# EAGLE design anemo5 (EAGLE 6.6.0)
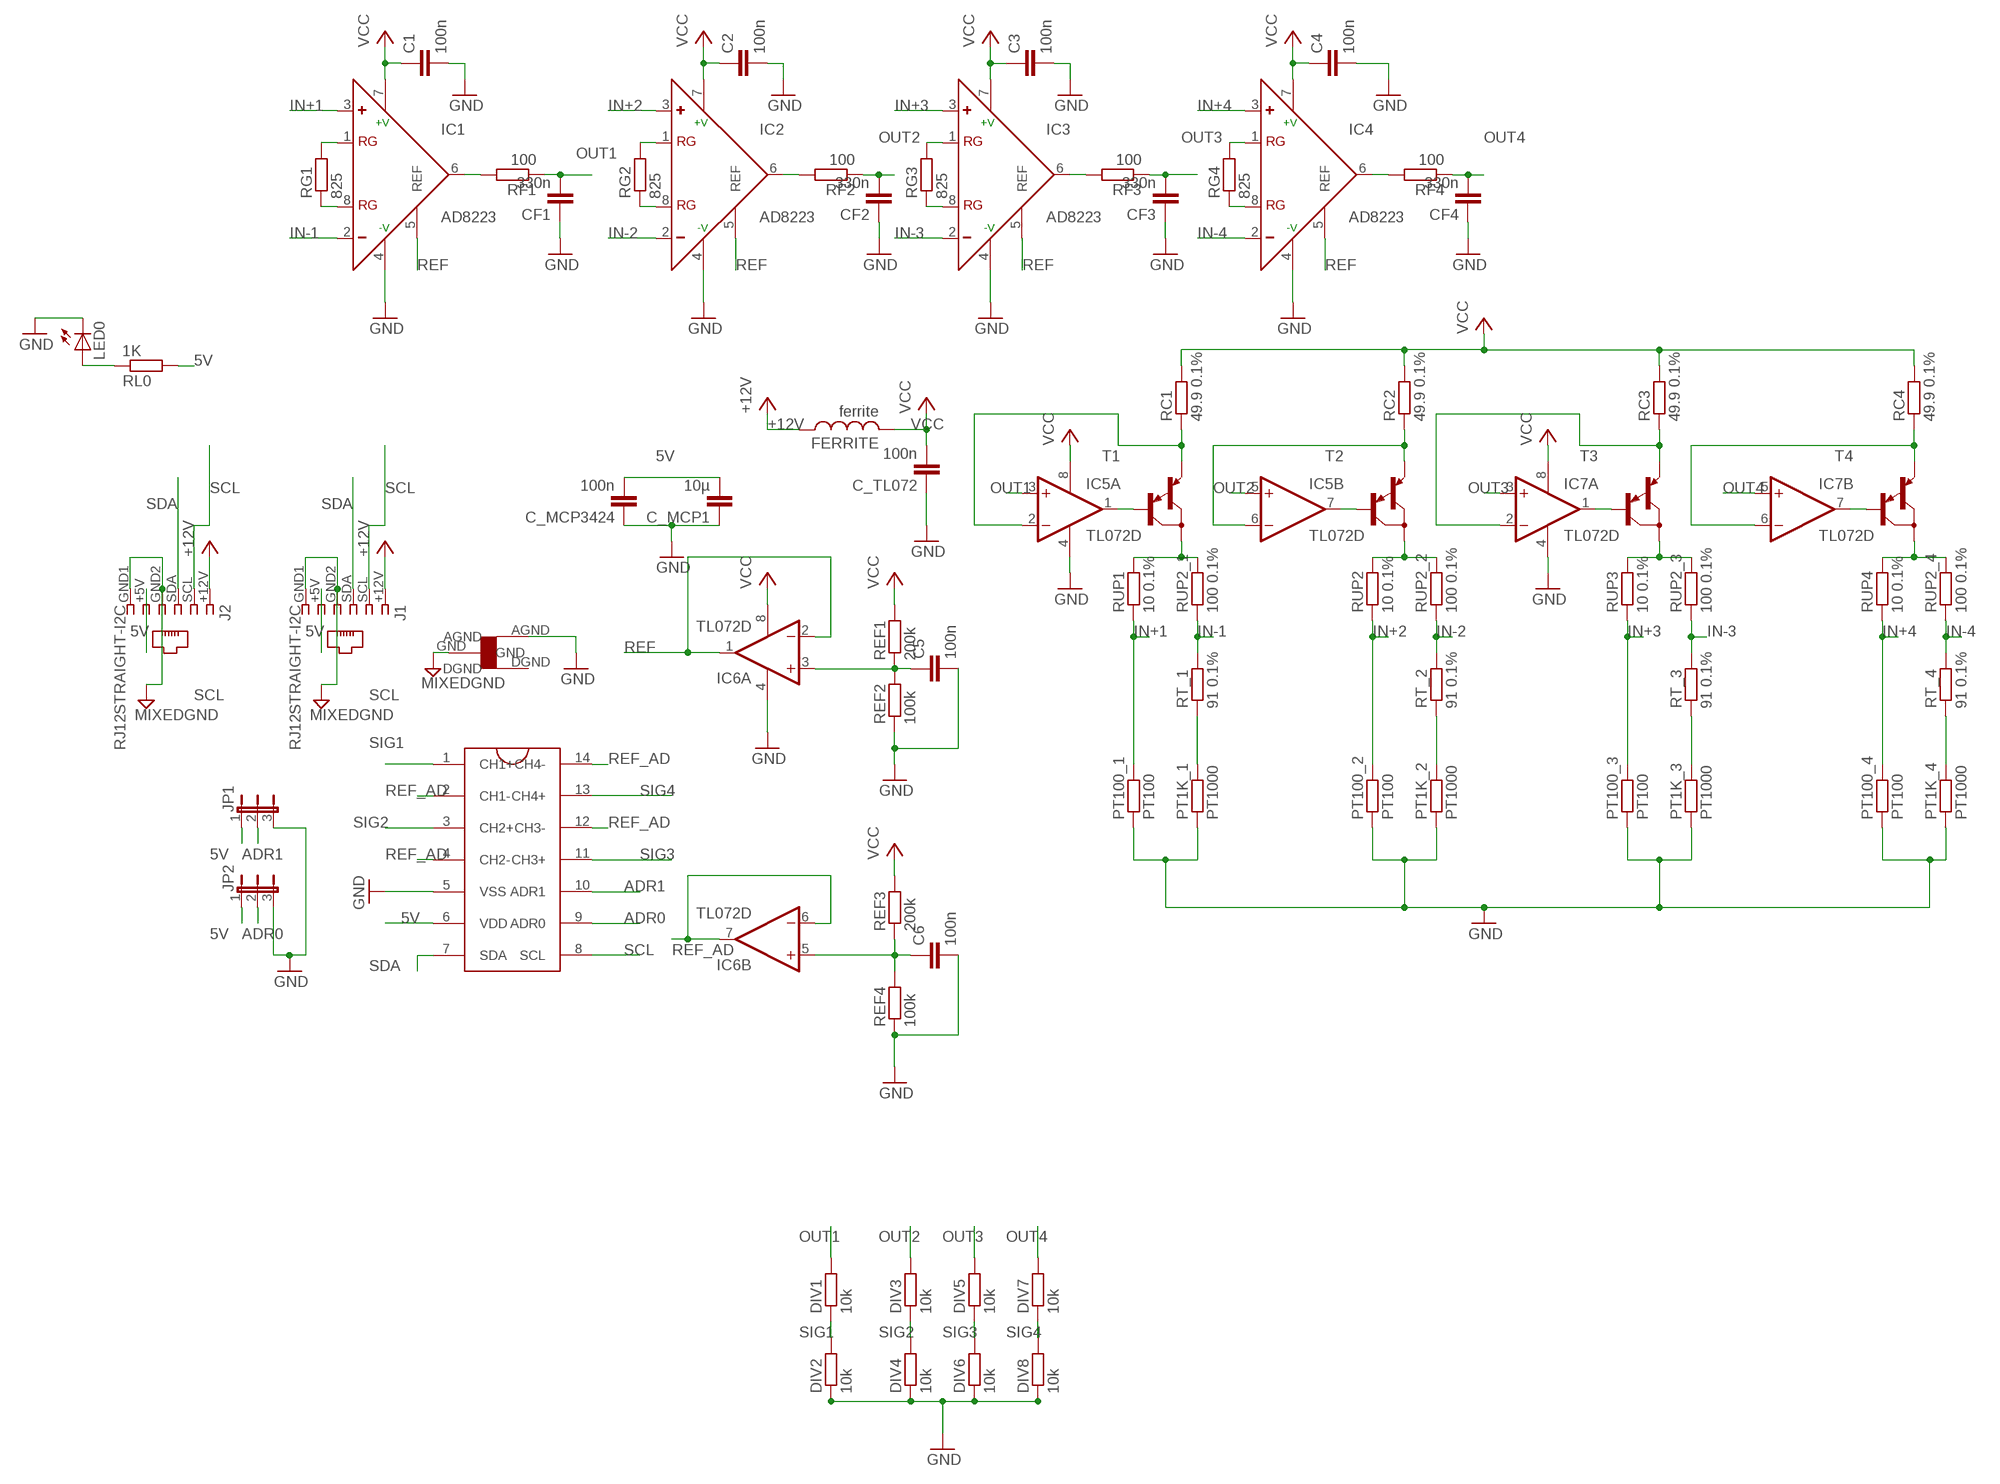
[diagram p0: schematic, sheet 1]

## Parts
C1  100n  C-EUC1206  [C1206]
C2  100n  C-EUC1206  [C1206]
C3  100n  C-EUC1206  [C1206]
C4  100n  C-EUC1206  [C1206]
C5  100n  C-EUC1206  [C1206]
C6  100n  C-EUC1206  [C1206]
C_MCP1  10µ  C-EUC1206  [C1206]
C_MCP3424  100n  C-EUC1206  [C1206]
C_TL072  100n  C-EUC1206  [C1206]
CF1  330n  C-EUC1206  [C1206]
CF2  330n  C-EUC1206  [C1206]
CF3  330n  C-EUC1206  [C1206]
CF4  330n  C-EUC1206  [C1206]
DIV1  10k  R-EU_M1206  [M1206]
DIV2  10k  R-EU_M1206  [M1206]
DIV3  10k  R-EU_M1206  [M1206]
DIV4  10k  R-EU_M1206  [M1206]
DIV5  10k  R-EU_M1206  [M1206]
DIV6  10k  R-EU_M1206  [M1206]
DIV7  10k  R-EU_M1206  [M1206]
DIV8  10k  R-EU_M1206  [M1206]
FERRITE  ferrite  L-USL3216C  [L3216C]
IC1  AD8223  AD620R  [SO8]
IC2  AD8223  AD620R  [SO8]
IC3  AD8223  AD620R  [SO8]
IC4  AD8223  AD620R  [SO8]
IC5  TL072D  [SO08]
IC6  TL072D  [SO08]
IC7  TL072D  [SO08]
J1  RJ12STRAIGHT-I2C  [RJ12-STRAIGHT-I2C]
J2  RJ12STRAIGHT-I2C  [RJ12-STRAIGHT-I2C]
JP1  JP2E  [JP2]
JP2  JP2E  [JP2]
LED0  LED1206  [LED-1206]
PT1K_1  PT1000  R-EU_M1206  [M1206]
PT1K_2  PT1000  R-EU_M1206  [M1206]
PT1K_3  PT1000  R-EU_M1206  [M1206]
PT1K_4  PT1000  R-EU_M1206  [M1206]
PT100_1  PT100  R-EU_M1206  [M1206]
PT100_2  PT100  R-EU_M1206  [M1206]
PT100_3  PT100  R-EU_M1206  [M1206]
PT100_4  PT100  R-EU_M1206  [M1206]
RC1  49.9 0.1%  R-EU_M1206  [M1206]
RC2  49.9 0.1%  R-EU_M1206  [M1206]
RC3  49.9 0.1%  R-EU_M1206  [M1206]
RC4  49.9 0.1%  R-EU_M1206  [M1206]
REF1  200k  R-EU_M1206  [M1206]
REF2  100k  R-EU_M1206  [M1206]
REF3  200k  R-EU_M1206  [M1206]
REF4  100k  R-EU_M1206  [M1206]
RF1  100  R-EU_M1206  [M1206]
RF2  100  R-EU_M1206  [M1206]
RF3  100  R-EU_M1206  [M1206]
RF4  100  R-EU_M1206  [M1206]
RG1  825  R-EU_M1206  [M1206]
RG2  825  R-EU_M1206  [M1206]
RG3  825  R-EU_M1206  [M1206]
RG4  825  R-EU_M1206  [M1206]
RL0  1K  R-EU_M1206  [M1206]
RT_1  91 0.1%  R-EU_M1206  [M1206]
RT_2  91 0.1%  R-EU_M1206  [M1206]
RT_3  91 0.1%  R-EU_M1206  [M1206]
RT_4  91 0.1%  R-EU_M1206  [M1206]
RUP1  10 0.1%  R-EU_M1206  [M1206]
RUP2  10 0.1%  R-EU_M1206  [M1206]
RUP2_1  100 0.1%  R-EU_M1206  [M1206]
RUP2_2  100 0.1%  R-EU_M1206  [M1206]
RUP2_3  100 0.1%  R-EU_M1206  [M1206]
RUP2_4  100 0.1%  R-EU_M1206  [M1206]
RUP3  10 0.1%  R-EU_M1206  [M1206]
RUP4  10 0.1%  R-EU_M1206  [M1206]
T1  MMBTA64LT1-PNP_DARL-SOT23-BEC  [SOT23-BEC]
T2  MMBTA64LT1-PNP_DARL-SOT23-BEC  [SOT23-BEC]
T3  MMBTA64LT1-PNP_DARL-SOT23-BEC  [SOT23-BEC]
T4  MMBTA64LT1-PNP_DARL-SOT23-BEC  [SOT23-BEC]
U$1  MCP3424(SO14)  [14LDSOIC]
U$2  STARGND  [STAR]

## Nets
5V: C_MCP1.2 C_MCP3424.2 J1.+5V J2.+5V JP1.1 JP2.1 RL0.2 U$1.6(VDD)
+12V: FERRITE.1 J1.+12V J2.+12V
ADR0: JP2.2 U$1.9(ADR0)
ADR1: JP1.2 U$1.10(ADR1)
GND [gnd]: C1.2 C2.2 C3.2 C4.2 C5.2 C6.2 C_MCP1.1 C_MCP3424.1 C_TL072.1 CF1.1 CF2.1 CF3.1 CF4.1 DIV2.1 DIV4.1 DIV6.1 DIV8.1 IC1.4(-V) IC2.4(-V) IC3.4(-V) IC4.4(-V) IC5.4(P:V-) IC6.4(P:V-) IC7.4(P:V-) JP1.3 JP2.3 LED0.C PT1K_1.1 PT1K_2.1 PT1K_3.1 PT1K_4.1 PT100_1.1 PT100_2.1 PT100_3.1 PT100_4.1 REF2.1 REF4.1 U$1.5(VSS) U$2.AGND
IN+1: IC1.3(+) PT100_1.2 RUP1.1
IN+2: IC2.3(+) PT100_2.2 RUP2.1
IN+3: IC3.3(+) PT100_3.2 RUP3.1
IN+4: IC4.3(+) PT100_4.2 RUP4.1
IN-1: IC1.2(-) RT_1.2 RUP2_1.1
IN-2: IC2.2(-) RT_2.2 RUP2_2.1
IN-3: IC3.2(-) RT_3.2 RUP2_3.1
IN-4: IC4.2(-) RT_4.2 RUP2_4.1
MIXEDGND [gnd]: J1.GND1 J1.GND2 J2.GND1 J2.GND2 U$2.GND
N$1: IC1.1(RG) RG1.2
N$2: IC1.8(RG) RG1.1
N$3: IC2.8(RG) RG2.1
N$4: IC2.1(RG) RG2.2
N$5: IC3.1(RG) RG3.2
N$6: IC3.8(RG) RG3.1
N$7: IC4.1(RG) RG4.2
N$8: IC4.8(RG) RG4.1
N$9: RUP1.2 RUP2_1.2 T1.C
N$10: C5.1 IC6.3(A:+IN) REF1.1 REF2.2
N$11: RUP2.2 RUP2_2.2 T2.C
N$12: RUP2_3.2 RUP3.2 T3.C
N$13: RUP2_4.2 RUP4.2 T4.C
N$14: LED0.A RL0.1
N$15 [highpower]: IC5.2(A:-IN) RC1.1 T1.E
N$16 [highpower]: IC5.6(B:-IN) RC2.1 T2.E
N$17 [highpower]: IC7.2(A:-IN) RC3.1 T3.E
N$18: IC1.6(OUT) RF1.2
N$19: IC2.6(OUT) RF2.2
N$20: IC3.6(OUT) RF3.2
N$21: IC4.6(OUT) RF4.2
N$22 [highpower]: IC7.6(B:-IN) RC4.1 T4.E
N$23: PT1K_1.2 RT_1.1
N$24: C6.1 IC6.5(B:+IN) REF3.1 REF4.2
N$25: PT1K_2.2 RT_2.1
N$27: PT1K_3.2 RT_3.1
N$29: PT1K_4.2 RT_4.1
OUT1: CF1.2 DIV1.2 IC5.3(A:+IN) RF1.1
OUT1A: IC5.1(A:OUT) T1.B
OUT2: CF2.2 DIV3.2 IC5.5(B:+IN) RF2.1
OUT2A: IC5.7(B:OUT) T2.B
OUT3: CF3.2 DIV5.2 IC7.3(A:+IN) RF3.1
OUT3A: IC7.1(A:OUT) T3.B
OUT4: CF4.2 DIV7.2 IC7.5(B:+IN) RF4.1
OUT4A: IC7.7(B:OUT) T4.B
REF: IC1.5(REF) IC2.5(REF) IC3.5(REF) IC4.5(REF) IC6.1(A:OUT) IC6.2(A:-IN)
REF_AD: IC6.6(B:-IN) IC6.7(B:OUT) U$1.2(CH1-) U$1.4(CH2-) U$1.12(CH3-) U$1.14(CH4-)
SCL: J1.SCL J2.SCL U$1.8(SCL)
SDA: J1.SDA J2.SDA U$1.7(SDA)
SIG1: DIV1.1 DIV2.2 U$1.1(CH1+)
SIG2: DIV3.1 DIV4.2 U$1.3(CH2+)
SIG3: DIV5.1 DIV6.2 U$1.11(CH3+)
SIG4: DIV7.1 DIV8.2 U$1.13(CH4+)
VCC [highpower]: C1.1 C2.1 C3.1 C4.1 C_TL072.2 FERRITE.2 IC1.7(+V) IC2.7(+V) IC3.7(+V) IC4.7(+V) IC5.8(P:V+) IC6.8(P:V+) IC7.8(P:V+) RC1.2 RC2.2 RC3.2 RC4.2 REF1.2 REF3.2
Unconnected: U$2.DGND

## Library data of the parts
C1-C6 C_MCP1 C_MCP3424 C_TL072 CF1-CF4 = rcl:C-EU: CAPACITOR, European symbol
DIV1-DIV8 PT1K_1-PT1K_4 PT100_1-PT100_4 RC1-RC4 REF1-REF4 RF1-RF4 RG1-RG4 RL0 RT_1-RT_4 RUP1 RUP2 RUP2_1-RUP2_4 RUP3 RUP4 = resistor:R-EU_: RESISTOR, European symbol
FERRITE = rcl:L-US: INDUCTOR, American symbol
IC1-IC4 = analog-devices:AD620: Low Cost, Low Power, Instrumentation Amplifier Source: http://www.analog.com/UploadedFiles/Data_Sheets/37793330023930AD620_e.pdf; MPN: AD620AR; OC_FARNELL: 1464424; OC_NEWARK: 05F7109
IC5-IC7 = linear:TL072: OP AMP
J1 J2 = lpatiny:RJ12: CORCOM Modular RJ Jacks No Shield Source: www.tycoelectronics.com .. ENG_DS_1654001_1099_RJ_L_0507.pdf
JP1 JP2 = jumper:JP2E: JUMPER
LED0 = SparkFun:LED: LEDs Standard schematic elements and footprints for 5mm, 3mm, 1206, and 0603 sized LEDs. 5mm - Spark Fun Electronics SKU : COM-00529 (and others)
T1-T4 = transistor:*-PNP_DARL-: PNP Darlington Transistor
U$1 = mcp3424:MCP3424(SO14)
U$2 = lpatiny:STARGND

## Net classes
0 default: width 0.406 mm
1 gnd: width 0.406 mm
2 highpower: width 0.61 mm

## Board
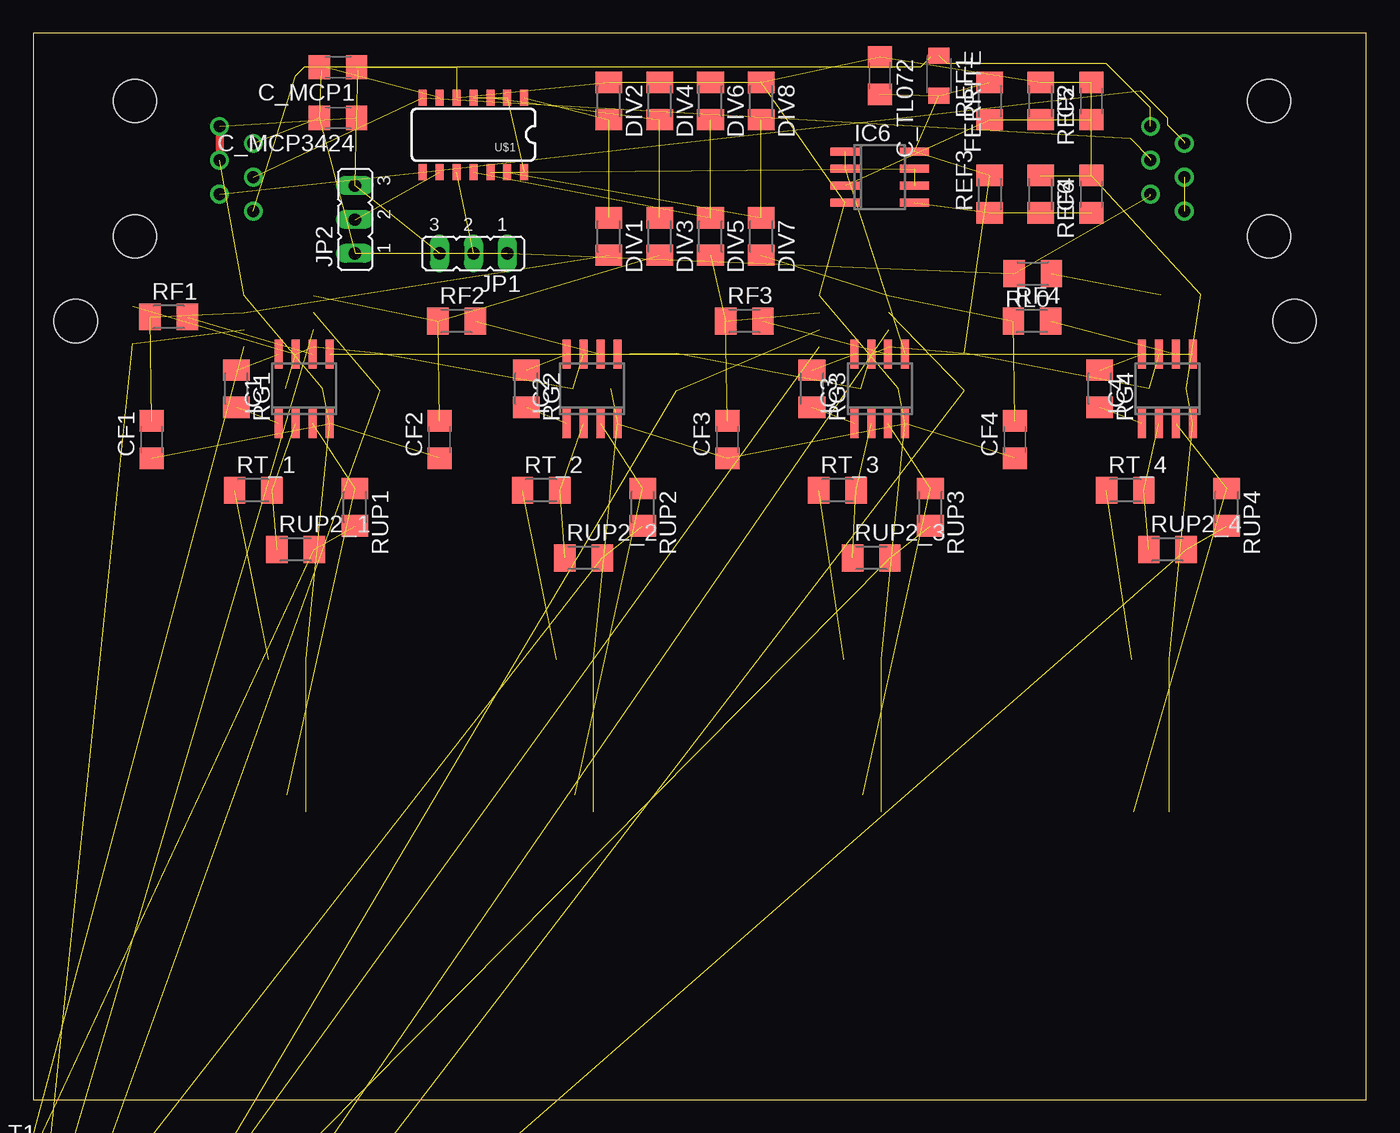
[diagram p1: board, top side]
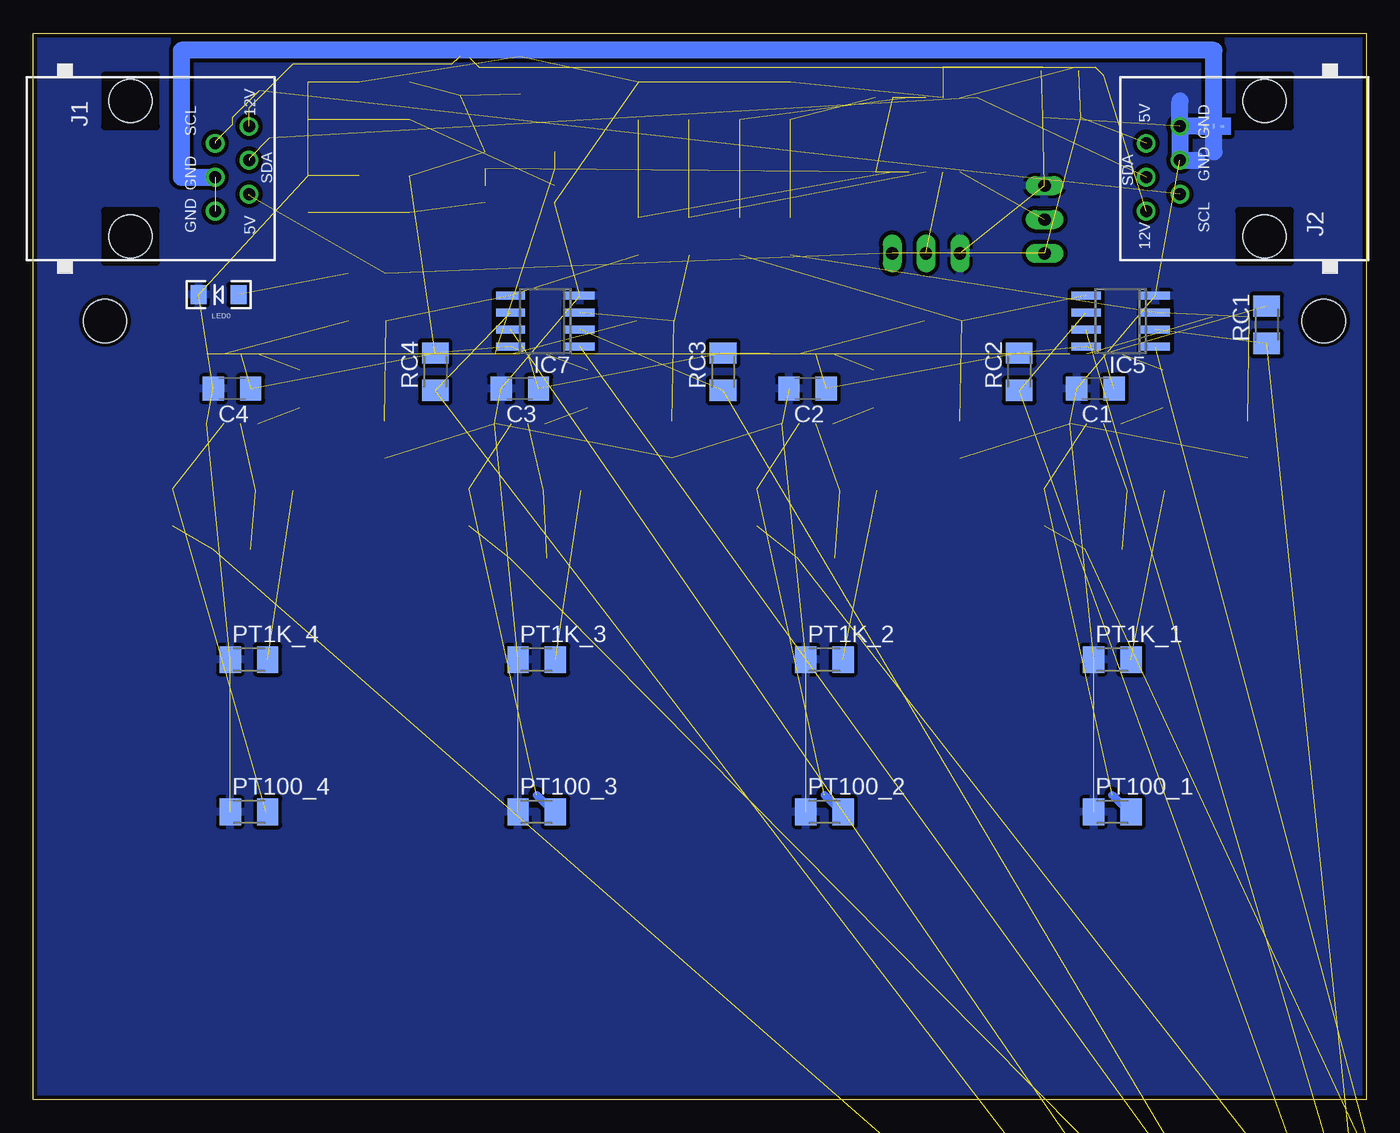
[diagram p2: board, bottom side, seen from below]

Size 100 x 80 mm. Coordinates in mm from the lower left corner, seen from the top.
Outline: 0,0 100,0 100,80 0,80 0,0
Copper layers (1*16): Top 0.035mm / dielectric 1.5mm / Bottom 0.035mm
Design rules "Fusion_eagle_rule_v1.1 *": minimum track width 6mil, minimum drill 0.5mm, track to track 10mil, track to pad 10mil, pad to pad 10mil, via to via 10mil, smd to smd 0mil, copper to edge 10mil, drill to drill 10mil, minimum pad ring 10mil, minimum via ring 6mil, stop-mask expansion 2mil, vias tented up to drill 100mil, thermal gap 10mil
Holes 3.25 mm at 3.17,58.42 94.61,58.42
vRestrict: area -2.5,-1.3 to 102.9,50.8

### Footprints (pad centres in the part's own frame; a part is rotated, then mirrored left to right if it is on the bottom)
C1206 = smd 1.6 x 1.8: 1 -1.4,0; 2 1.4,0
M1206 = smd 1.6 x 2: 1 -1.4,0; 2 1.4,0
L3216C = smd 1.2 x 1.6: 1 -1.5,0; 2 1.5,0
SO8 = smd 0.6 x 2.2: 1 -1.905,-2.6; 2 -0.635,-2.6; 3 0.635,-2.6; 4 1.905,-2.6; 5 1.905,2.6; 6 0.635,2.6; 7 -0.635,2.6; 8 -1.905,2.6
SO08 = smd 0.6 x 2.2: 1 -1.905,-2.6; 2 -0.635,-2.6; 3 0.635,-2.6; 4 1.905,-2.6; 5 1.905,2.6; 6 0.635,2.6; 7 -0.635,2.6; 8 -1.905,2.6
RJ12-STRAIGHT-I2C = drill 0.9 pad 1.4: +5V 1.905,8.89; +12V -3.175,8.89; GND1 3.175,6.35; GND2 0.635,6.35; SCL -1.905,6.35; SDA -0.635,8.89 | hole 3.251: -5.08,0; 5.08,0
JP2 = drill 0.914 long: 1 -2.54,0; 2 0,0; 3 2.54,0
LED-1206 = smd 1.2 x 1.4: A -1.5,0; C 1.5,0
SOT23-BEC = smd 1 x 1.4: B -0.95,-1.1; C 0,1.1; E 0.95,-1.1
14LDSOIC = smd 1.2 x 0.6: 1 -2.8,3.81; 2 -2.8,2.54; 3 -2.8,1.27; 4 -2.8,0; 5 -2.8,-1.27; 6 -2.8,-2.54; 7 -2.8,-3.81; 8 2.8,-3.81; 9 2.8,-2.54; 10 2.8,-1.27; 11 2.8,0; 12 2.8,1.27; 13 2.8,2.54; 14 2.8,3.81
STAR = smd 0.152 x 0.305: AGND 0.635,-0.635; DGND 0.635,0.635 | smd 0.305 x 0.152: GND 0.635,0

### Placement (x,y rotation side)
C1  20.32,53.34 180 bottom
C2  41.91,53.34 180 bottom
C3  63.5,53.34 180 bottom
C4  85.09,53.34 180 bottom
C5  79.38,74.93 90 top
C6  79.38,67.94 90 top
C_MCP1  22.86,77.47 180 top
C_MCP3424  22.86,73.66 180 top
C_TL072  63.5,76.83 270 top
CF1  8.89,49.53 90 top
CF2  30.48,49.53 90 top
CF3  52.07,49.53 90 top
CF4  73.66,49.53 90 top
DIV1  43.18,64.77 270 top
DIV2  43.18,74.93 270 top
DIV3  46.99,64.77 270 top
DIV4  46.99,74.93 270 top
DIV5  50.8,64.77 270 top
DIV6  50.8,74.93 270 top
DIV7  54.61,64.77 270 top
DIV8  54.61,74.93 270 top
FERRITE  67.94,76.83 270 top
IC1  20.32,53.34 0 top
IC2  41.91,53.34 0 top
IC3  63.5,53.34 0 top
IC4  85.09,53.34 0 top
IC5  18.41,58.42 90 bottom
IC6  63.5,69.22 270 top
IC7  61.59,58.42 90 bottom
J1  92.71,69.85 270 bottom
J2  7.62,69.85 90 bottom
JP1  33.02,63.5 180 top
JP2  24.13,66.04 90 top
LED0  86.11,60.4 180 bottom
PT1K_1  19.05,33.02 0 bottom
PT1K_2  40.64,33.02 0 bottom
PT1K_3  62.23,33.02 0 bottom
PT1K_4  83.82,33.02 0 bottom
PT100_1  19.05,21.59 0 bottom
PT100_2  40.64,21.59 0 bottom
PT100_3  62.23,21.59 0 bottom
PT100_4  83.82,21.59 0 bottom
RC1  7.47,58.14 90 bottom
RC2  26.04,54.61 90 bottom
RC3  48.26,54.61 90 bottom
RC4  69.85,54.61 90 bottom
REF1  71.75,74.93 90 top
REF2  75.56,74.93 270 top
REF3  71.75,67.94 90 top
REF4  75.56,67.94 270 top
RF1  10.16,58.72 0 top
RF2  31.75,58.42 0 top
RF3  53.34,58.42 0 top
RF4  74.93,58.42 0 top
RG1  15.24,53.34 270 top
RG2  36.98,53.34 270 top
RG3  58.42,53.34 270 top
RG4  80.01,53.34 270 top
RL0  74.98,61.98 180 top
RT_1  16.51,45.72 0 top
RT_2  38.1,45.72 0 top
RT_3  60.33,45.72 0 top
RT_4  81.92,45.72 0 top
RUP1  24.13,44.45 270 top
RUP2  45.72,44.45 270 top
RUP2_1  19.68,41.27 0 top
RUP2_2  41.27,40.64 0 top
RUP2_3  62.87,40.64 0 top
RUP2_4  85.09,41.27 0 top
RUP3  67.31,44.45 270 top
RUP4  89.53,44.45 270 top
T1  0,-5.08 0 top  (outside the outline)
T2  0,-15.24 0 top  (outside the outline)
T3  0,-25.4 0 top  (outside the outline)
T4  0,-35.56 0 top  (outside the outline)
U$1  33.02,72.39 270 top
U$2  11.43,73.66 270 bottom

### Tracks (layer width: path | path; a pad name or v marks a point on that pad's centre or on a via)
5V  (8 unrouted)
  Top 0.61: 21.84,77.47 C_MCP1.2 21.59,77.22
+12V  (10 unrouted)
  Top 0.61: 67.31,78.23 67.82,78.23 FERRITE.1
ADR0  (1 unrouted)
ADR1  (1 unrouted)
GND  (39 unrouted)
  Top 0.61: C_TL072.1 | 24.38,77.22 C_MCP1.1
  Bottom 1.27: 11.43,71.12 11.43,73.03 U$2.AGND 13.97,73.03 | 13.97,73.03 13.97,74.93 | 13.97,73.03 13.97,70.48 12.7,70.48
  pour Bottom (isolate 0.305): -0.03,80.01 99.69,80.01 99.69,0 0,-0.03
IN+1  (2 unrouted)
  Bottom 0.61: 19.05,22.86 17.78,21.59 PT100_1.2
IN+2  (2 unrouted)
  Bottom 0.61: 40.64,22.86 39.37,21.59 PT100_2.2
IN+3  (2 unrouted)
  Bottom 0.61: 62.23,22.86 60.96,21.59 PT100_3.2
IN+4  (2 unrouted)
  Bottom 0.61: 82.55,21.59 PT100_4.2
IN-1  (2 unrouted)
IN-2  (2 unrouted)
IN-3  (2 unrouted)
IN-4  (2 unrouted)
MIXEDGND  (1 unrouted)
  Top 0.61: J2.GND1 J2.GND2
  Bottom 1.27: J1.GND2 88.9,69.22 88.9,78.74 11.43,78.74 U$2.GND J2.GND1 J2.GND2
N$1  (1 unrouted)
N$2  (1 unrouted)
N$3  (1 unrouted)
N$4  (1 unrouted)
N$5  (1 unrouted)
N$6  (1 unrouted)
N$7  (1 unrouted)
N$8  (1 unrouted)
N$9  (2 unrouted)
N$10  (3 unrouted)
N$11  (2 unrouted)
N$12  (2 unrouted)
N$13  (2 unrouted)
N$14  (1 unrouted)
N$15  (2 unrouted)
N$16  (2 unrouted)
N$17  (2 unrouted)
N$18  (1 unrouted)
N$19  (1 unrouted)
N$20  (1 unrouted)
N$21  (1 unrouted)
N$22  (2 unrouted)
N$23  (1 unrouted)
N$24  (3 unrouted)
N$25  (1 unrouted)
N$27  (1 unrouted)
N$29  (1 unrouted)
OUT1  (3 unrouted)
OUT1A  (1 unrouted)
OUT2  (3 unrouted)
OUT2A  (1 unrouted)
OUT3  (3 unrouted)
OUT3A  (1 unrouted)
OUT4  (3 unrouted)
OUT4A  (1 unrouted)
REF  (5 unrouted)
REF_AD  (5 unrouted)
SCL  (6 unrouted)
SDA  (4 unrouted)
SIG1  (2 unrouted)
SIG2  (2 unrouted)
SIG3  (2 unrouted)
SIG4  (2 unrouted)
VCC  (18 unrouted)

### Text on the board
tValues: Anemometer v5